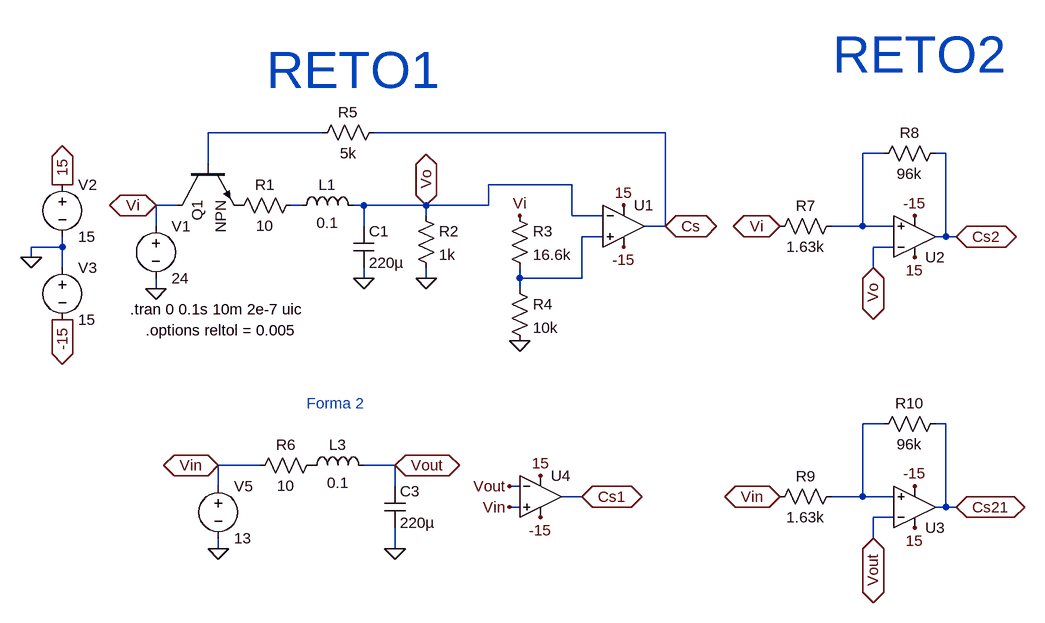
[diagram p0: schematic Reto12_ON_OFF.asc]
Reto12_ON_OFF.asc, the LTspice schematic file:
Version 4.1
SHEET 1 2576 704
WIRE 96 -32 -80 -32
WIRE 624 -32 176 -32
WIRE 960 0 928 0
WIRE 1056 0 1040 0
WIRE -80 16 -80 -32
WIRE 480 48 352 48
WIRE -128 80 -160 80
WIRE 64 80 48 80
WIRE 160 80 144 80
WIRE 256 80 160 80
WIRE 352 80 352 48
WIRE 352 80 256 80
WIRE 256 96 256 80
WIRE 480 96 480 48
WIRE 528 96 480 96
WIRE -160 112 -160 80
WIRE 160 112 160 80
WIRE 624 112 624 -32
WIRE 624 112 592 112
WIRE 928 112 928 0
WIRE 928 112 880 112
WIRE 976 112 928 112
WIRE 528 128 496 128
WIRE 1056 128 1056 0
WIRE 1056 128 1040 128
WIRE 1072 128 1056 128
WIRE -304 144 -304 128
WIRE -304 144 -352 144
WIRE 976 144 944 144
WIRE -352 160 -352 144
WIRE -304 176 -304 144
WIRE 944 176 944 144
WIRE 160 192 160 176
WIRE 256 192 256 176
WIRE 400 192 400 176
WIRE 496 192 496 128
WIRE 496 192 400 192
WIRE -160 208 -160 192
WIRE 400 208 400 192
WIRE 960 416 928 416
WIRE 1056 416 1040 416
WIRE 0 480 -64 480
WIRE 208 480 160 480
WIRE -64 512 -64 480
WIRE 208 512 208 480
WIRE 400 512 384 512
WIRE 496 528 464 528
WIRE 928 528 928 416
WIRE 928 528 880 528
WIRE 976 528 928 528
WIRE 400 544 384 544
WIRE 1056 544 1056 416
WIRE 1056 544 1040 544
WIRE 1072 544 1056 544
WIRE 976 560 944 560
WIRE 944 592 944 560
WIRE -64 608 -64 592
WIRE 208 608 208 576
FLAG -160 208 0
FLAG 256 192 0
FLAG 160 192 0
FLAG -352 160 0
FLAG -304 48 15
IOPIN -304 48 Out
FLAG -304 256 -15
IOPIN -304 256 Out
FLAG 256 80 Vo
IOPIN 256 80 BiDir
FLAG -160 80 Vi
IOPIN -160 80 BiDir
FLAG 400 96 Vi
FLAG 560 80 15
FLAG 560 144 -15
FLAG 400 288 0
FLAG 624 112 Cs
IOPIN 624 112 BiDir
FLAG 384 544 Vin
FLAG 384 512 Vout
FLAG 432 560 -15
FLAG 432 496 15
FLAG 496 528 Cs1
IOPIN 496 528 BiDir
FLAG 208 608 0
FLAG -64 608 0
FLAG -64 480 Vin
IOPIN -64 480 BiDir
FLAG 208 480 Vout
IOPIN 208 480 BiDir
FLAG 1008 96 -15
FLAG 1008 160 15
FLAG 1072 128 Cs2
IOPIN 1072 128 BiDir
FLAG 800 112 Vi
IOPIN 800 112 BiDir
FLAG 944 176 Vo
IOPIN 944 176 BiDir
FLAG 1008 512 -15
FLAG 1008 576 15
FLAG 1072 544 Cs21
IOPIN 1072 544 BiDir
FLAG 800 528 Vin
IOPIN 800 528 BiDir
FLAG 944 592 Vout
IOPIN 944 592 BiDir
SYMBOL res 64 64 R90
WINDOW 0 0 56 VBottom 2
WINDOW 3 32 56 VTop 2
SYMATTR InstName R1
SYMATTR Value 10
SYMBOL voltage -160 96 R0
SYMATTR InstName V1
SYMATTR Value 24
SYMBOL ind 48 96 R270
WINDOW 0 32 56 VTop 2
WINDOW 3 5 56 VBottom 2
SYMATTR InstName L1
SYMATTR Value 0.1
SYMBOL cap 144 112 R0
SYMATTR InstName C1
SYMATTR Value 220µ
SYMBOL res 240 80 R0
SYMATTR InstName R2
SYMATTR Value 1k
SYMBOL OpAmps\\UniversalOpAmp2 560 112 R0
SYMATTR InstName U1
SYMBOL voltage -304 32 R0
SYMATTR InstName V2
SYMATTR Value 15
SYMBOL voltage -304 160 R0
SYMATTR InstName V3
SYMATTR Value 15
SYMBOL res 384 80 R0
SYMATTR InstName R3
SYMATTR Value 16.6k
SYMBOL res 384 192 R0
SYMATTR InstName R4
SYMATTR Value 10k
SYMBOL npn -128 16 M90
SYMATTR InstName Q1
SYMBOL res 192 -48 R90
WINDOW 0 0 56 VBottom 2
WINDOW 3 32 56 VTop 2
SYMATTR InstName R5
SYMATTR Value 5k
SYMBOL OpAmps\\UniversalOpAmp2 432 528 R0
SYMATTR InstName U4
SYMBOL res 96 464 R90
WINDOW 0 0 56 VBottom 2
WINDOW 3 32 56 VTop 2
SYMATTR InstName R6
SYMATTR Value 10
SYMBOL ind 64 496 R270
WINDOW 0 32 56 VTop 2
WINDOW 3 5 56 VBottom 2
SYMATTR InstName L3
SYMATTR Value 0.1
SYMBOL cap 192 512 R0
SYMATTR InstName C3
SYMATTR Value 220µ
SYMBOL voltage -64 496 R0
SYMATTR InstName V5
SYMATTR Value 13
SYMBOL res 896 96 R90
WINDOW 0 0 56 VBottom 2
WINDOW 3 32 56 VTop 2
SYMATTR InstName R7
SYMATTR Value 1.63k
SYMBOL res 1056 -16 R90
WINDOW 0 0 56 VBottom 2
WINDOW 3 32 56 VTop 2
SYMATTR InstName R8
SYMATTR Value 96k
SYMBOL OpAmps\\UniversalOpAmp2 1008 128 M180
SYMATTR InstName U2
SYMBOL res 896 512 R90
WINDOW 0 0 56 VBottom 2
WINDOW 3 32 56 VTop 2
SYMATTR InstName R9
SYMATTR Value 1.63k
SYMBOL res 1056 400 R90
WINDOW 0 0 56 VBottom 2
WINDOW 3 32 56 VTop 2
SYMATTR InstName R10
SYMATTR Value 96k
SYMBOL OpAmps\\UniversalOpAmp2 1008 544 M180
SYMATTR InstName U3
TEXT -200 240 Left 2 !.tran 0 0.1s 10m 2e-7 uic
TEXT 144 -128 Center 6 ;RETO1
TEXT 1016 -152 Center 6 ;RETO2
TEXT 72 384 Left 2 ;Forma 2
TEXT -176 272 Left 2 !.options reltol = 0.005

The netlist it stands for:
* Reto12_ON_OFF.asc
R1 N003 P001 10
V1 Vi 0 24
L1 N003 Vo 0.1
C1 Vo 0 220µ
R2 Vo 0 1k
X§U1 N004 Vo 15 -15 Cs level2 Avol=1Meg GBW=10Meg Slew=10Meg Ilimit=25m Rail=0 Vos=0 En=0 Enk=0 In=0 Ink=0 Rin=500Meg  ; pins In+ In- V+ V- OUT
V2 15 0 15
V3 0 -15 15
R3 Vi N004 16.6k
R4 N004 0 10k
Q1 Vi N001 P001 0 NPN
R5 Cs N001 5k
X§U4 Vin Vout 15 -15 Cs1 level2 Avol=1Meg GBW=10Meg Slew=10Meg Ilimit=25m Rail=0 Vos=0 En=0 Enk=0 In=0 Ink=0 Rin=500Meg  ; pins In+ In- V+ V- OUT
R6 P002 Vin 10
L3 P002 Vout 0.1
C3 Vout 0 220µ
V5 Vin 0 13
R7 N002 Vi 1.63k
R8 Cs2 N002 96k
X§U2 N002 Vo 15 -15 Cs2 level2 Avol=1Meg GBW=10Meg Slew=10Meg Ilimit=25m Rail=0 Vos=0 En=0 Enk=0 In=0 Ink=0 Rin=500Meg  ; pins In+ In- V+ V- OUT
R9 N005 Vin 1.63k
R10 Cs21 N005 96k
X§U3 N005 Vout 15 -15 Cs21 level2 Avol=1Meg GBW=10Meg Slew=10Meg Ilimit=25m Rail=0 Vos=0 En=0 Enk=0 In=0 Ink=0 Rin=500Meg  ; pins In+ In- V+ V- OUT
.model NPN NPN
.model PNP PNP
.lib standard.bjt
.tran 0 0.1s 10m 2e-7 uic
* RETO1
* RETO2
* Forma 2
.options reltol = 0.005
.lib UniversalOpAmp2.lib
.backanno
.end